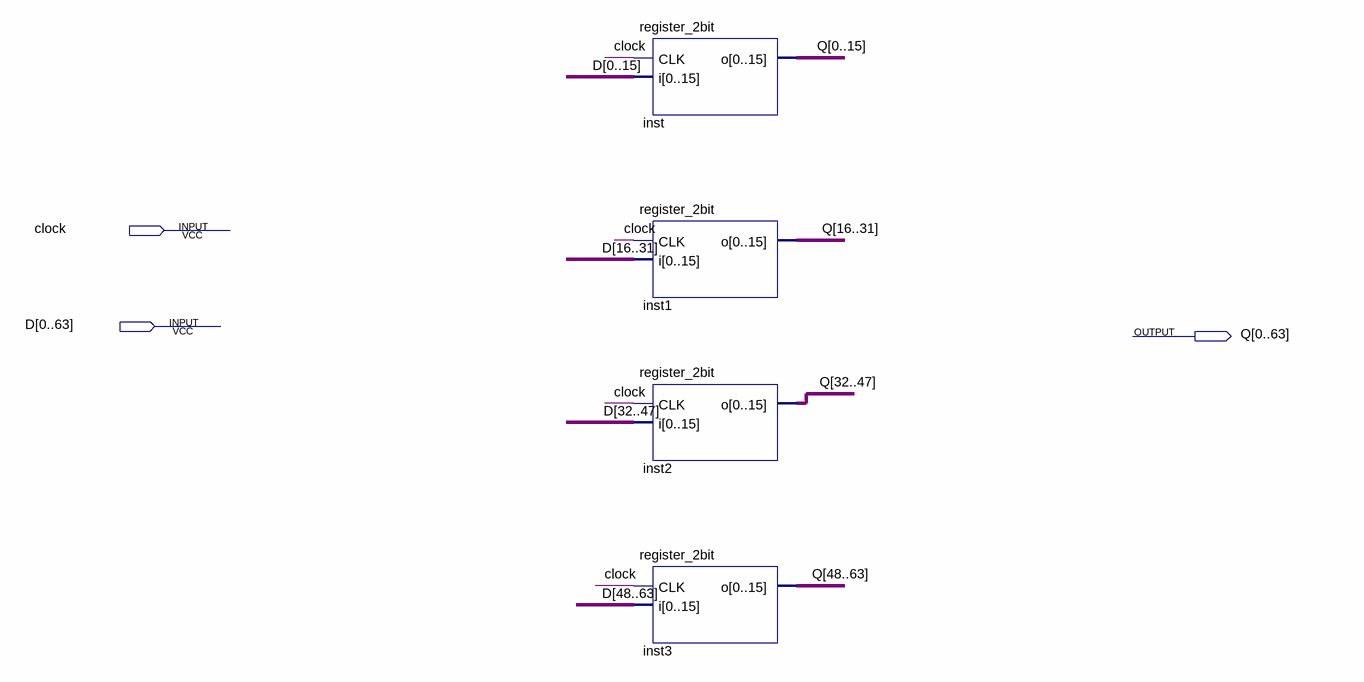
[diagram p0: schematic sheet]
// Quartus schematic register_8byte.bdf as structural Verilog: 4 symbols, 3 pins
module register_8byte (
  input  clock,
  input  [0:63] D,
  output [0:63] Q
);

  register_2bit inst (.CLK(clock), .i(D[0:15]), .o(Q[0:15]));
  register_2bit inst1 (.CLK(clock), .i(D[16:31]), .o(Q[16:31]));
  register_2bit inst2 (.CLK(clock), .i(D[32:47]), .o(Q[32:47]));
  register_2bit inst3 (.CLK(clock), .i(D[48:63]), .o(Q[48:63]));
endmodule
